# Altium schematic sheet 大直-絕境擴散-空氣消毒系統.SchDoc
size A3
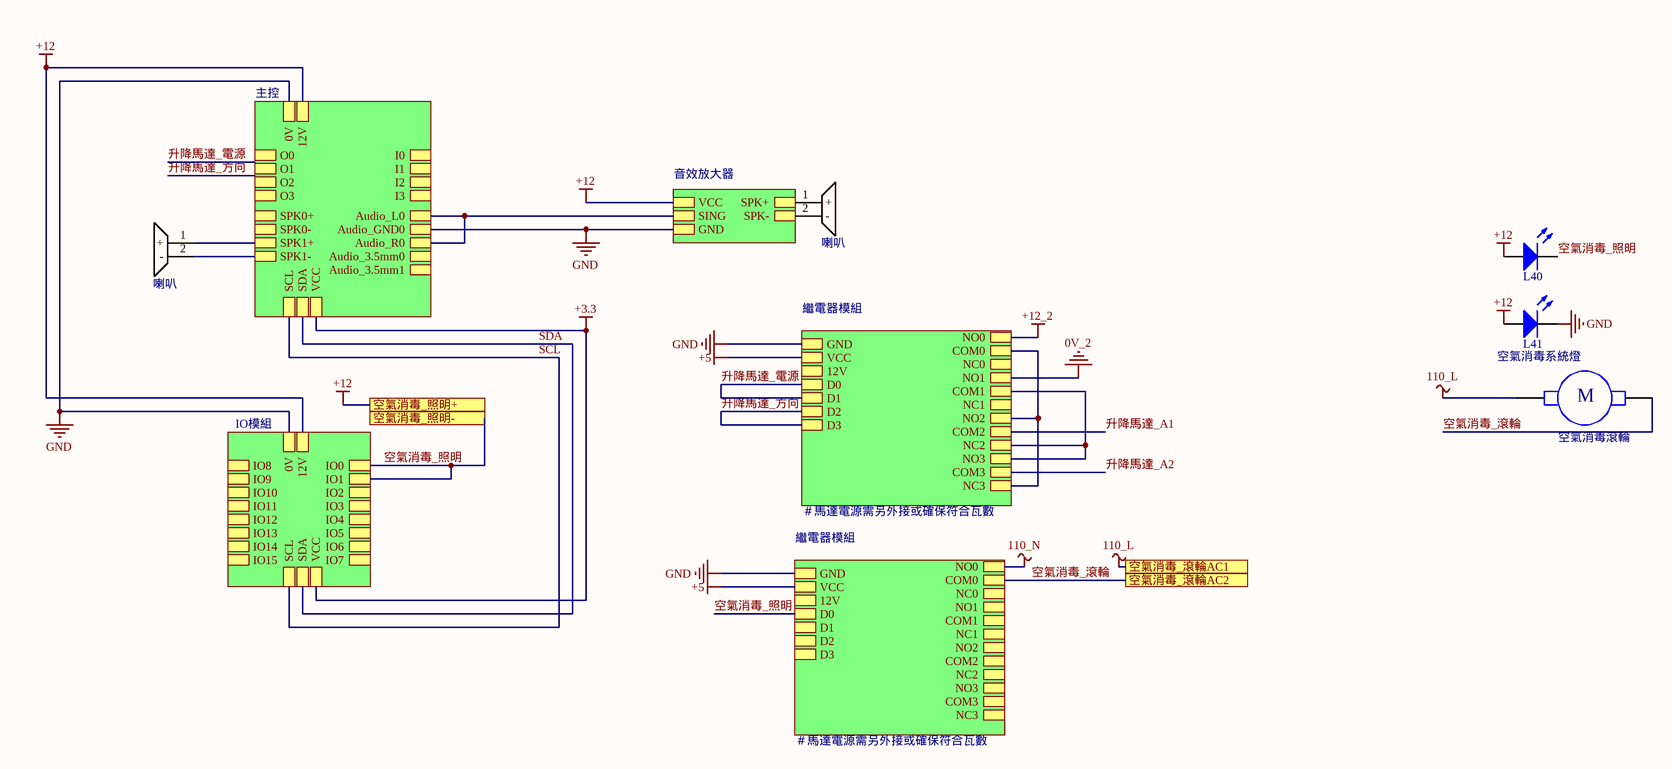
[diagram p0: 大直-絕境擴散-空氣消毒系統.SchDoc]

## Parts
B14  喇叭  [Buzzer_12085]
B15  喇叭  [Buzzer_12085]
L40  藍  [LED-0603]  (value not drawn)
L41  藍  [LED-0603]  (value not drawn)
MD3  空氣消毒滾輪

## Sub-sheets
IO模組 = IO模組_MCP23017_20240819.SchDoc: VCC, 12V, 0V, SCL, SDA, IO15, IO14, IO10, IO0, IO3, IO4, IO5, IO8, IO11, IO6, IO7, IO12, IO13, IO2, IO1, IO9
主控 = ESP32主控_20240812.SchDoc: 12V, SDA, VCC, 0V, SCL, O3, O2, O1, O0, I3, I2, I1, I0, SPK0+, Audio_3.5mm1, Audio_L0, SPK0-, Audio_R0, SPK1+, SPK1-, Audio_3.5mm0, Audio_GND0
繼電器模組 = 遙控繼電器.SchDoc: COM0, NO1, NO2, COM1, NC0, NO3, NO0, VCC, COM2, NC2, NC3, COM3, NC1, GND, 12V, D3, D2, D1, D0
繼電器模組 = 遙控繼電器.SchDoc: COM0, NO1, NO2, COM1, NC0, NO3, NO0, VCC, COM2, NC2, NC3, COM3, NC1, GND, 12V, D3, D2, D1, D0
音效放大器 = File Name: VCC, SING, GND, SPK-, SPK+

## Ports
空氣消毒_滾輪AC1, 空氣消毒_滾輪AC2, 空氣消毒_照明+, 空氣消毒_照明-

## Nets
0V_2: sheet 繼電器模組/NO1
110_L: MD3.4 ; port 空氣消毒_滾輪AC1
110_N: sheet 繼電器模組/NO0
+3.3: sheet 主控/VCC, sheet IO模組/VCC
+5: sheet 繼電器模組/VCC, sheet 繼電器模組/VCC
+12: L40.2(A) L41.2(A) ; port 空氣消毒_照明+, sheet 主控/12V, sheet 音效放大器/VCC, sheet IO模組/12V
+12_2: sheet 繼電器模組/NO0
GND: L41.1(K) ; sheet 主控/0V, sheet 主控/Audio_GND0, sheet 音效放大器/GND, sheet IO模組/0V, sheet 繼電器模組/GND, sheet 繼電器模組/GND
SCL: sheet 主控/SCL, sheet IO模組/SCL
SDA: sheet 主控/SDA, sheet IO模組/SDA
升降馬達_A1: sheet 繼電器模組/COM2
升降馬達_A2: sheet 繼電器模組/COM3
升降馬達_方向: sheet 繼電器模組/D3, sheet 繼電器模組/D2
升降馬達_電源: sheet 繼電器模組/D1, sheet 繼電器模組/D0
空氣消毒_滾輪: MD3.4 ; port 空氣消毒_滾輪AC2, sheet 繼電器模組/COM0
空氣消毒_照明: L40.1(K) ; port 空氣消毒_照明-, sheet IO模組/IO0, sheet IO模組/IO1, sheet 繼電器模組/D0
NetB14_1: B14.1(+) ; sheet 音效放大器/SPK+
NetB14_2: B14.2(-) ; sheet 音效放大器/SPK-
NetB15_1: B15.1(+) ; sheet 主控/SPK1+
NetB15_2: B15.2(-) ; sheet 主控/SPK1-
(unnamed): sheet 主控/Audio_L0, sheet 主控/Audio_R0, sheet 音效放大器/SING
(unnamed): sheet 繼電器模組/COM0, sheet 繼電器模組/NO2, sheet 繼電器模組/NC3
(unnamed): sheet 繼電器模組/COM1, sheet 繼電器模組/NO3, sheet 繼電器模組/NC2

## Notes on the sheet
- 空氣消毒系統燈
- ＃馬達電源需另外接或確保符合瓦數
- (in symbol Motor_DC) M

## Library data of the parts
B14 B15 = Buzzer: 無源蜂鳴器
L40 L41 = LED
MD3 = Motor_DC: 直流馬達